# EAGLE design LED_board (EAGLE 7.4.0)
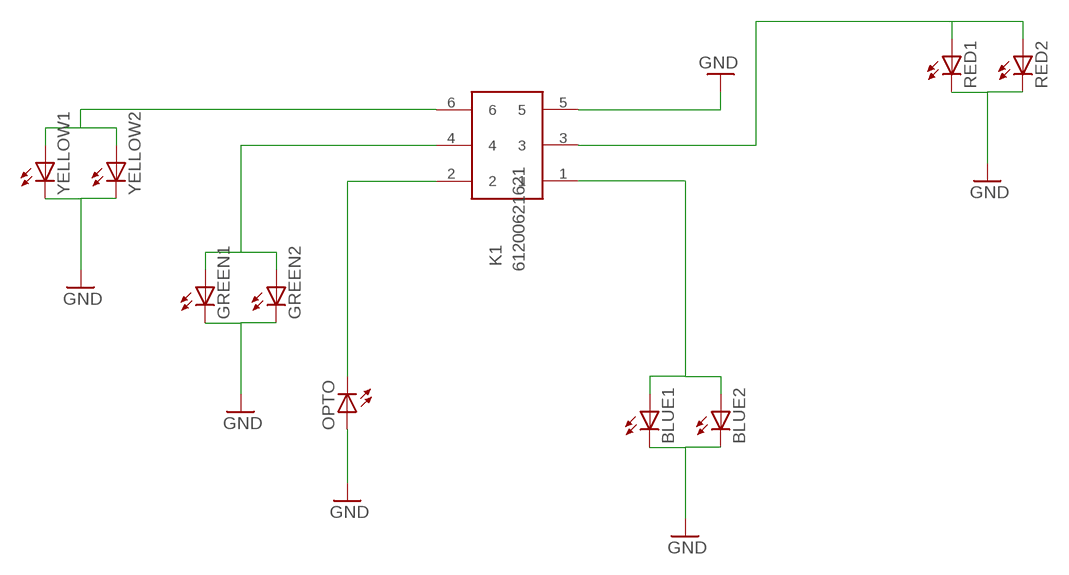
[diagram p0: schematic, sheet 1]

## Parts
BLUE1  LED5MM  [LED5MM]
BLUE2  LED5MM  [LED5MM]
GREEN1  LED5MM  [LED5MM]
GREEN2  LED5MM  [LED5MM]
K1  61200621621  [61200621621]
OPTO  LED5MM  [LED5MM]
RED1  LED5MM  [LED5MM]
RED2  LED5MM  [LED5MM]
YELLOW1  LED5MM  [LED5MM]
YELLOW2  LED5MM  [LED5MM]

## Nets
GND: BLUE1.K(C) BLUE2.K(C) GREEN1.K(C) GREEN2.K(C) K1.5 OPTO.A RED1.K(C) RED2.K(C) YELLOW1.K(C) YELLOW2.K(C)
N$1: K1.3 RED1.A RED2.A
N$2: GREEN1.A GREEN2.A K1.4
N$3: BLUE1.A BLUE2.A K1.1
N$4: K1.6 YELLOW1.A YELLOW2.A
N$5: K1.2 OPTO.K(C)

## Library data of the parts
BLUE1 BLUE2 GREEN1 GREEN2 OPTO RED1 RED2 YELLOW1 YELLOW2 = led:LED: LED OSRAM: - CHIPLED LG R971, LG N971, LY N971, LG Q971, LY Q971, LO R971, LY R971 LH N974, LH R974 LS Q976, LO Q976, LY Q976 LO Q996 - Hyper CHIPLED LW Q18S LB Q993, LB Q99A, LB R99A - SideLED LS A670, LO A670, LY A670, LG A670, LP A670 LB A673, LV A673, LT A673, LW A673 LH A674 LY A675 LS A676, LA A676, LO A676, LY A676, LW A676 LS A679, LY A679, LG A679 - Hyper Micro SIDELED® LS Y876, LA Y876, LO Y876, LY Y876 LT Y87S - SmartLED LW L88C, LW L88S LB L89C, LB L89S, LG L890 LS L89K, LO L89K, LY L89K LS L896, LA L896, LO L896, LY L896 - TOPLED LS T670, LO T670, LY T670, LG T670, LP T670 LSG T670, LSP T670, LSY T670, LOP T670, LYG T670 LG T671, LOG T671, LSG T671 LB T673, LV T673, LT T673, LW T673 LH T674 LS T676, LA T676, LO T676, LY T676, LB T676, LH T676, LSB T676, LW T676 LB T67C, LV T67C, LT T67C, LS T67K, LO T67K, LY T67K, LW E67C LS E67B, LA E67B, LO E67B, LY E67B, LB E67C, LV E67C, LT E67C LW T67C LS T679, LY T679, LG T679 LS T770, LO T770, LY T770, LG T770, LP T770 LB T773, LV T773, LT T773, LW T773 LH T774 LS E675, LA E675, LY E675, LS T675 LS T776, LA T776, LO T776, LY T776, LB T776 LHGB T686 LT T68C, LB T68C - Hyper Mini TOPLED® LB M676 - Mini TOPLED Santana® LG M470 LS M47K, LO M47K, LY M47K Source: http://www.osram.convergy.de LUXEON: - LUMILED® LXK2-PW12-R00, LXK2-PW12-S00, LXK2-PW14-U00, LXK2-PW14-V00 LXK2-PM12-R00, LXK2-PM12-S00, LXK2-PM14-U00 LXK2-PE12-Q00, LXK2-PE12-R00, LXK2-PE12-S00, LXK2-PE14-T00, LXK2-PE14-U00 LXK2-PB12-K00, LXK2-PB12-L00, LXK2-PB12-M00, LXK2-PB14-N00, LXK2-PB14-P00, LXK2-PB14-Q00 LXK2-PR12-L00, LXK2-PR12-M00, LXK2-PR14-Q00, LXK2-PR14-R00 LXK2-PD12-Q00, LXK2-PD12-R00, LXK2-PD12-S00 LXK2-PH12-R00, LXK2-PH12-S00 LXK2-PL12-P00, LXK2-PL12-Q00, LXK2-PL12-R00 Source: www.luxeon.com KINGBRIGHT: KA-3528ASYC Source: www.kingbright.com
K1 = Wurth_Elektronik_Electromechanic_Wire_to_Board_Connectors_rev15c:61200621621: WR-BHD 2.54mm Male Box Header, 6 Pins=>Code : Con_WTB_BHD_2.54_Male_THT_WS_61200621621 <http://katalog.we-online.de/media/thumbs2/eican/thb_Con_WTB_BHD_2.54_Male_THT_WS_6120xx21621_pf2.jpg> Details see: http://katalog.we-online.de/en/em/612_0xx_216_21 Created 2014-06-04, Karrer Zheng 2014 (C) Würth Elektronik

## Board
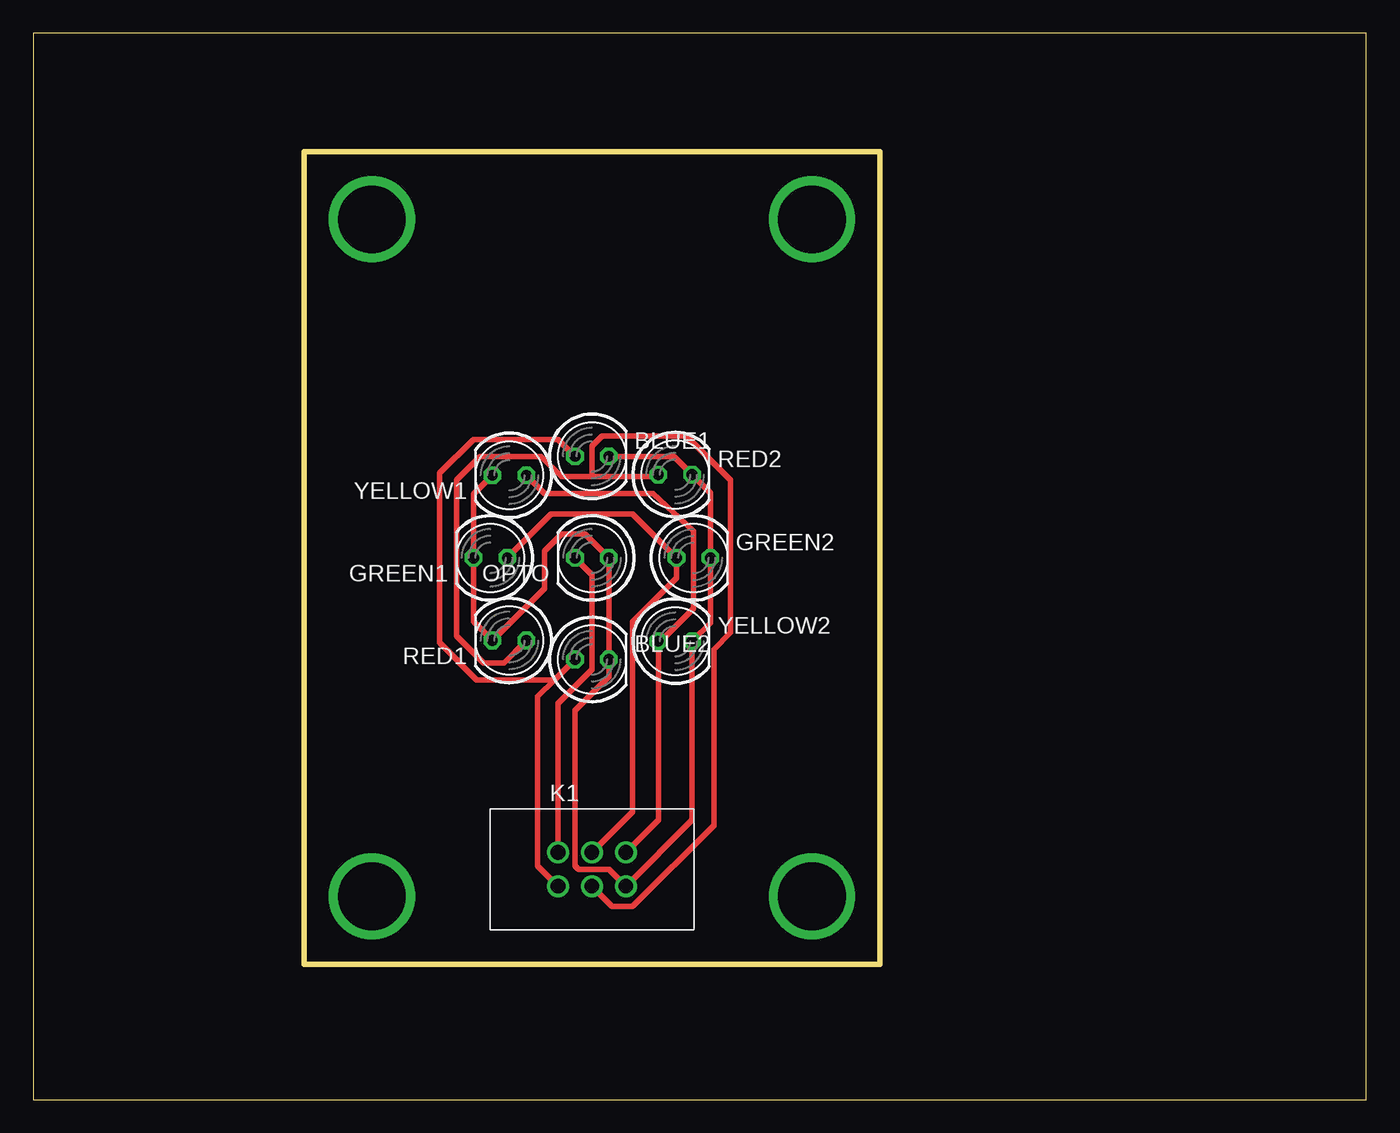
[diagram p1: board, top side]

Size 100 x 80 mm. Coordinates in mm from the lower left corner, seen from the top.
Outline: 0,0 100,0 100,80 0,80 0,0
Outline: 20.32,71.12 63.5,71.12 63.5,10.16 20.32,10.16 20.32,71.12
Copper layers (1*16): Top 0.035mm / dielectric 1.5mm / Bottom 0.035mm
Design rules "default": minimum track width 10mil, minimum drill 24mil, track to track 8mil, track to pad 8mil, pad to pad 8mil, via to via 8mil, smd to smd 8mil, copper to edge 40mil, drill to drill 8mil, minimum pad ring 10mil, minimum via ring 8mil, stop-mask expansion 4mil, vias tented up to drill 0mil, thermal gap 10mil

### Footprints (pad centres in the part's own frame; a part is rotated, then mirrored left to right if it is on the bottom)
LED5MM = drill 0.813 octagon: A -1.27,0; K 1.27,0
61200621621 = drill 1.1: 1 -2.54,-1.27; 2 -2.54,1.27; 3 0,-1.27; 4 0,1.27; 5 2.54,-1.27; 6 2.54,1.27

### Placement (x,y rotation side)
BLUE1  41.91,48.26 0 top
BLUE2  41.91,33.02 0 top
GREEN1  34.29,40.64 180 top
GREEN2  49.53,40.64 0 top
K1  41.91,17.27 0 top
OPTO  41.91,40.64 180 top
RED1  35.71,34.44 180 top
RED2  48.16,46.89 0 top
YELLOW1  35.71,46.84 180 top
YELLOW2  48.16,34.39 0 top

### Tracks (layer width: path | path; a pad name or v marks a point on that pad's centre or on a via)
GND
  Top 0.406: BLUE1.K 48.06,48.26 RED2.K 50.8,45.52 GREEN2.K 50.8,35.76 YELLOW2.K 49.43,20.98 K1.5 43.18,17.27 40.89,17.27 40.64,17.53 40.64,29.21 43.18,31.75 BLUE2.K OPTO.A 41.4,42.42 39.62,42.42 38.35,41.15 38.35,38.35 RED1.K 33.02,35.87 GREEN1.K 33.02,45.41 YELLOW1.K
N$1
  Top 0.406: 46.79,46.99 RED2.A 46.74,46.74 41.91,46.74 | RED1.A 35.31,32.77 33.78,32.77 31.75,34.8 31.75,46.48 33.53,48.26 38.1,48.26 39.62,46.74 41.91,46.74 | 41.91,46.74 41.91,49.02 42.67,49.78 49.02,49.78 52.32,46.48 52.32,35.05 51.05,33.78 51.05,20.57 44.96,14.48 43.43,14.48 K1.3
N$2
  Top 0.406: GREEN1.A 38.86,43.94 44.96,43.94 GREEN2.A 48.26,39.12 44.96,35.81 44.96,21.59 K1.4
N$3
  Top 0.406: BLUE1.A 39.37,49.53 33.02,49.53 30.48,46.99 30.48,34.29 33.27,31.5 39.12,31.5 | BLUE2.A 39.12,31.5 | 39.12,31.5 37.85,30.23 37.85,17.53 K1.1
N$4
  Top 0.406: YELLOW1.A 38.35,45.47 46.48,45.47 49.53,42.67 49.53,36.83 47.09,34.39 YELLOW2.A 46.89,20.98 K1.6
N$5
  Top 0.406: K1.2 39.37,29.72 41.91,32.26 41.91,39.37 OPTO.K
N$6  (via drill 5.08 pad 6.45)
  other vias: 58.42,66.04
N$10  (via drill 5.08 pad 6.45)
  other vias: 25.4,15.24
N$14  (via drill 5.08 pad 6.45)
  other vias: 25.4,66.04
N$15  (via drill 5.08 pad 6.45)
  other vias: 58.42,15.24